# EAGLE design pwr_pos_bipolar (EAGLE 7.5.0)
Rusia Neagra MKII
TITLE: Rusia Neagra MKII
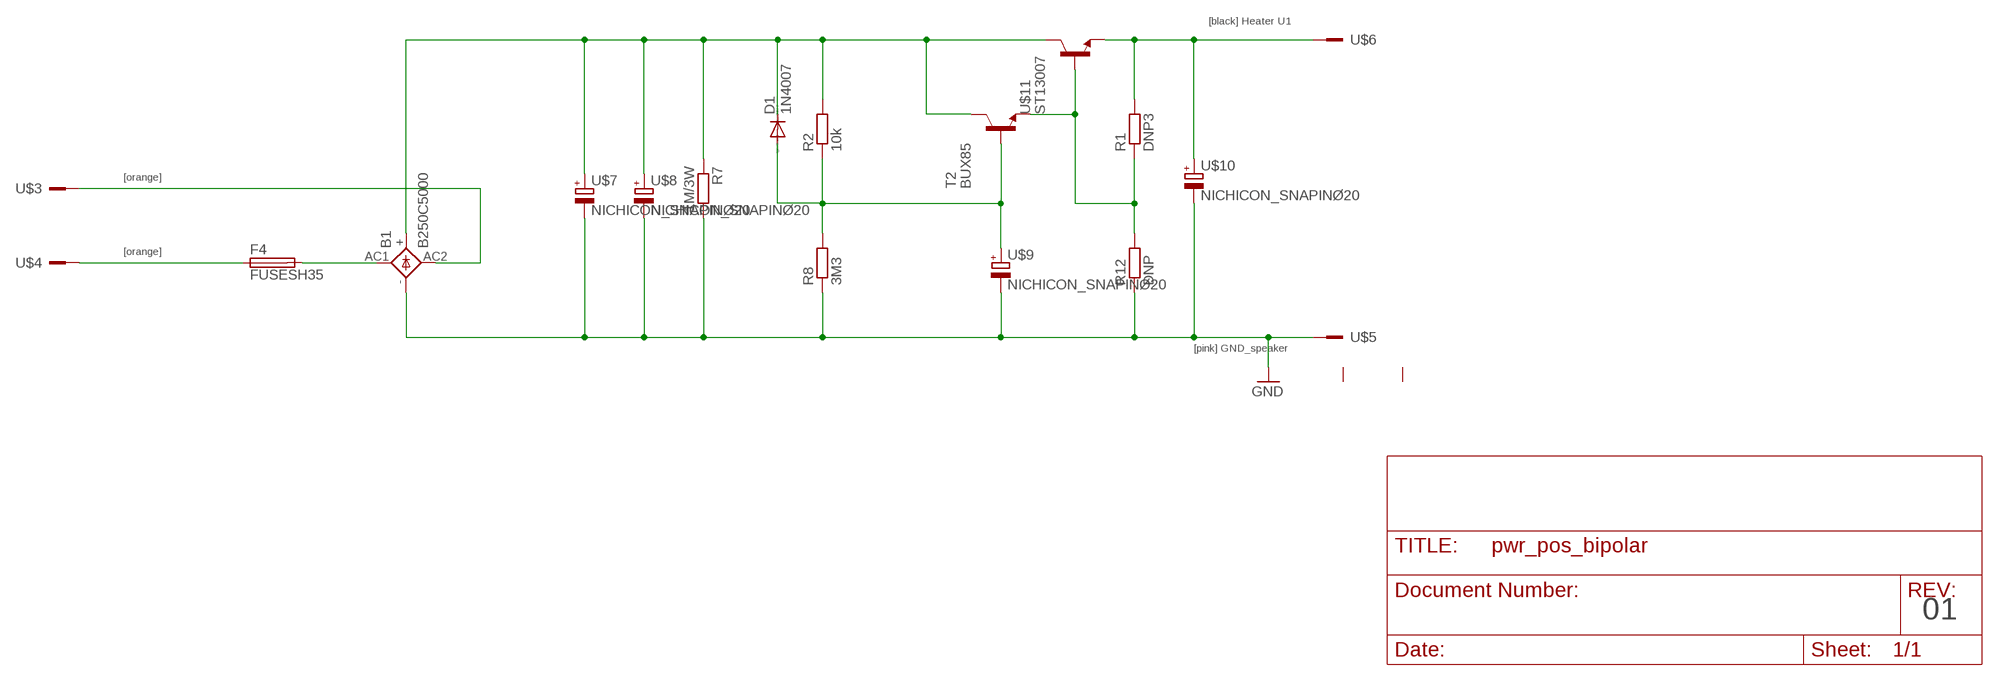
[diagram p0: schematic, sheet 1]

## Parts
B1  B250C5000  DIOTEC_BC5000  [DIOTEC_BC5000]
D1  1N4007  1N4004  [DO41-10]
F4  FUSESH35  [SH25]
R1  DNP3  R-EU_0411/12  [0411/12]
R2  10k  R-EU_0411/12  [0411/12]
R7  1M/3W  R-EU_0922V  [0922V]
R8  3M3  R-EU_0411/12  [0411/12]
R12  DNP  R-EU_0411/12  [0411/12]
T2  BUX85  -NPN-TO220V  [TO220V]
U$1  SK456-60-3XM3L  [SK456-60-3XM3L]
U$2  RN_POWER  [RN]
U$3  M1  [M1_OFFSET]
U$4  M1  [M1_OFFSET]
U$5  M1  [M1_OFFSET]
U$6  M1  [M1_OFFSET]
U$7  NICHICON_SNAPINØ20  [C_20G10]
U$8  NICHICON_SNAPINØ20  [C_20G10]
U$9  NICHICON_SNAPINØ20  [C_20G10]
U$10  NICHICON_SNAPINØ20  [C_20G10]
U$11  ST13007  NPN-POWER  [TOP3V_TO220]

## Nets
30VAC_1: B1.AC2 U$3.1(KL)
30VAC_2: F4.1 U$4.1(KL)
GND: B1.- R7.2 R8.1 R12.1 U$5.1(KL) U$7.- U$8.- U$9.- U$10.-
N$2: B1.AC1 F4.2
N$12: R1.1 R12.2 T2.3(E) U$11.B U$11.B$1(B)
N$14: D1.A R2.1 R8.2 T2.1(B) U$9.+
N_C: B1.+ D1.C R2.2 R7.1 T2.2(C) U$7.+ U$8.+ U$11.C
V-: R1.2 U$6.1(KL) U$10.+ U$11.E U$11.E$1(E)
Unconnected: U$1.P$1 U$1.P$2 U$2.SH@1 U$2.SH@2 U$2.SH@3 U$2.SH@4

## Notes on the sheet
- [black] Heater U1
- [orange]
- [orange]
- [pink] GND_speaker
- 01

## Library data of the parts
B1 = Simplex-DiscreteSemi:DIOTEC_BC5000: DIOTEC RECTIFIER B..C5000-3000A, B..C5000-3300A grid 1 x 10, 2 x 7,5 mm
D1 = diode:1N4004: DIODE general purpose rectifier, 1 A
F4 = fuse:FUSE: Fuse; OC_FARNELL: unknown; OC_NEWARK: unknown
R1 R2 R7 R8 R12 = rcl:R-EU_: RESISTOR, European symbol
T2 = transistor:*-NPN-: NPN Transistror BF959 corrected 2008.03.06
U$1 = Simplex-Heatsinks:SK456-60-3XM3L: Fischer Elektronik SK456-60-3XM3L 2 pin heatsink 60x40, 40mm grid
U$2 = Simplex-Enclosures:RN_POWER: Rusia Neagra Amp power pcb
U$3-U$6 = Simplex-Connectors:M1: 1pin
U$7-U$10 = Simplex-rlc:NICHICON_SNAPIN: Nichicon snap-in capacitors
U$11 = Simplex-DiscreteSemi:NPN-POWER

## Net classes
1 vcc: width 0.203 mm

## Board
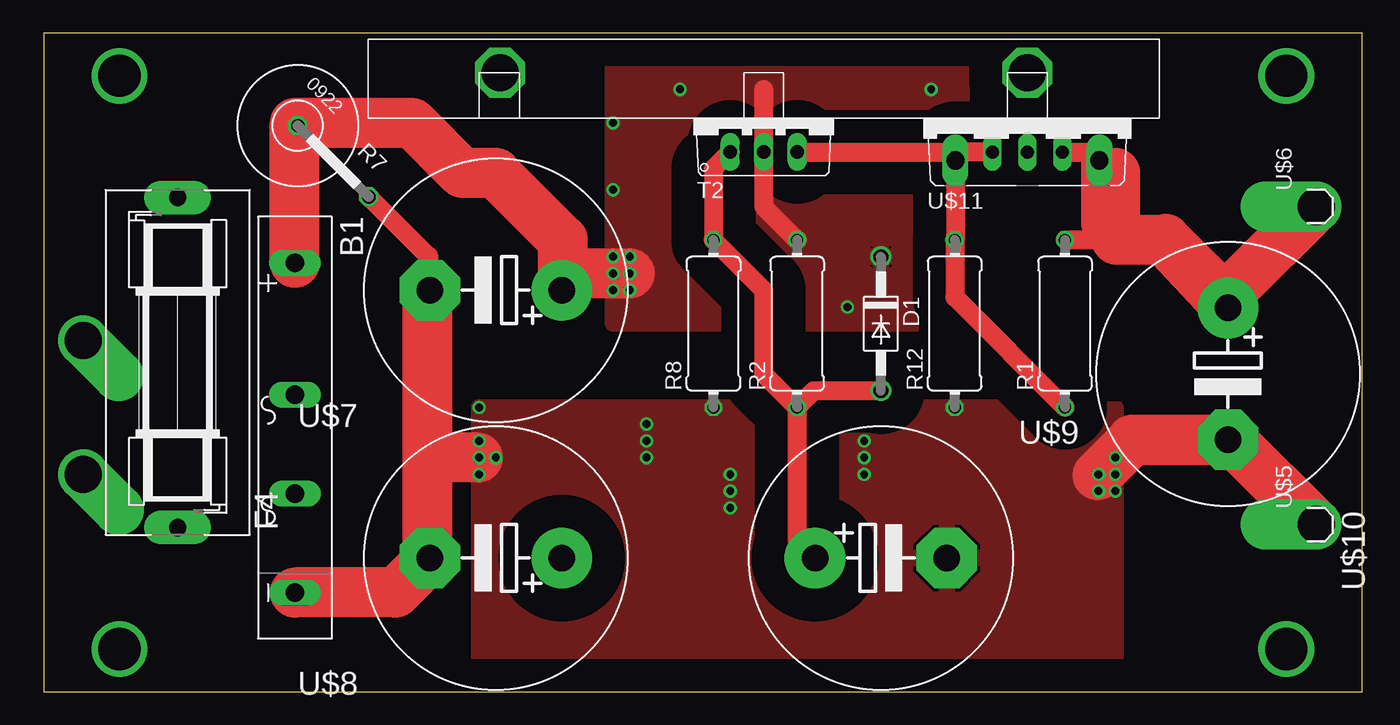
[diagram p1: board, top side]
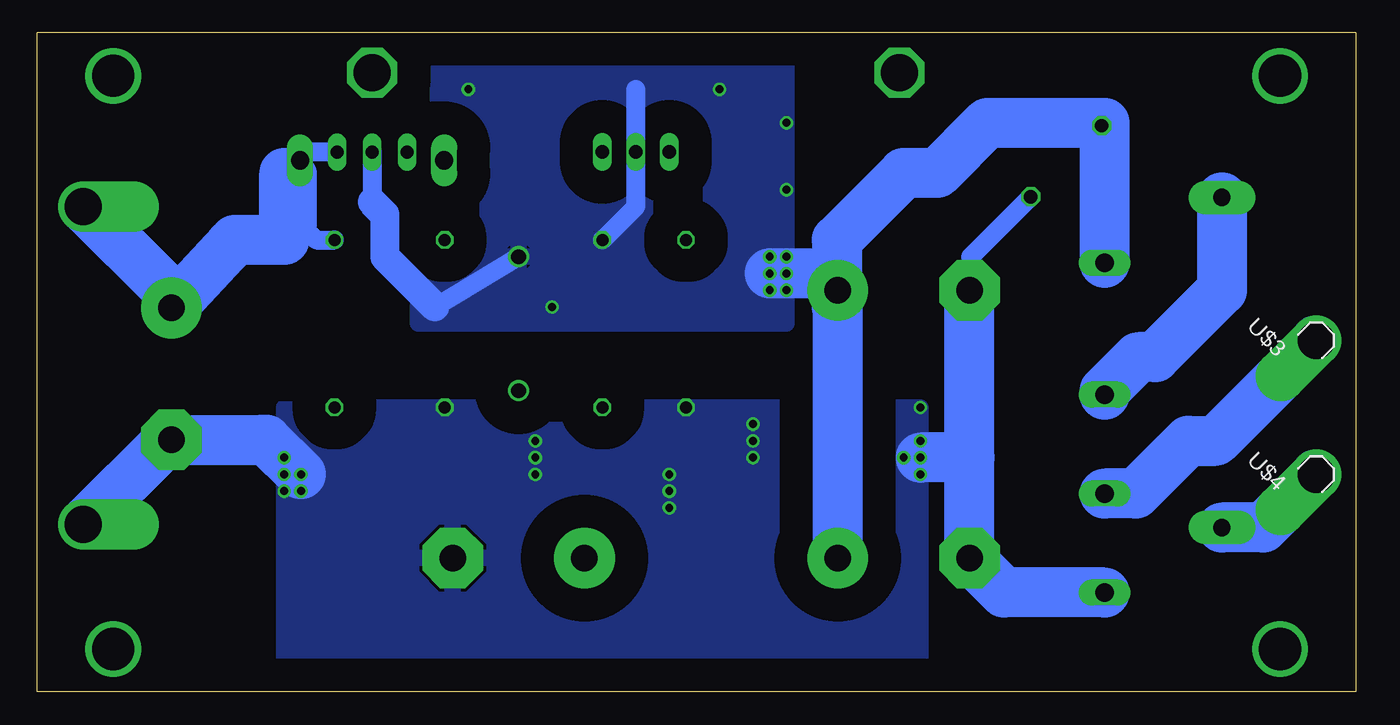
[diagram p2: board, bottom side, seen from below]

Size 100 x 50 mm. Coordinates in mm from the lower left corner, seen from the top.
Copper layers (1*16): Top 0.035mm / dielectric 1.5mm / Bottom 0.035mm
Design rules "default *": minimum track width 10mil, minimum drill 0.6mm, track to track 2mm, track to pad 2mm, pad to pad 2mm, via to via 2mm, smd to smd 2mm, copper to edge 40mil, drill to drill 8mil, minimum pad ring 0.2mm, minimum via ring 8mil, stop-mask expansion 4mil, vias tented up to drill 0mil, thermal gap 10mil

### Footprints (pad centres in the part's own frame; a part is rotated, then mirrored left to right if it is on the bottom)
DIOTEC_BC5000 = drill 1.397 long: + -13.5,0; - 11.5,0; AC1 -3.5,0; AC2 4,0
DO41-10 = drill 1.118: A 5.08,0; C -5.08,0
SH25 = drill 1.321 pad 2.54 long: 1 -12.522,0; 2 12.522,0
0411/12 = drill 0.914 octagon: 1 -6.35,0; 2 6.35,0
0922V = drill 1.016 octagon: 1 -5.08,0; 2 2.54,0
TO220V = drill 1.016 long: 1 -2.54,-2.54; 2 0,-2.54; 3 2.54,-2.54
SK456-60-3XM3L = drill 2.8 octagon: P$1 -20,0; P$2 20,0
RN = drill 3.2: SH@1 0,43.5; SH@2 88.5,43.5; SH@3 0,0; SH@4 88.5,0
M1_OFFSET = drill 2.8 pad 3.81 offset: 1 0,0
C_20G10 = drill 2.007 pad 4.597: + -5,0 | drill 2.007 pad 4.597 octagon: - 5,0
TOP3V_TO220 = drill 1.397 long: B -5.461,-3.175; E 5.461,-3.175 | drill 1 pad 1.27 long: B$1 -2.66,-2.54; C 0,-2.54; E$1 2.66,-2.54

### Placement (x,y rotation side)
B1  19.05,19.05 270 top
D1  63.5,27.94 270 top
F4  10.16,25 90 top
R1  77.47,27.94 90 top
R2  57.15,27.94 90 top
R7  22.86,39.37 315 top
R8  50.8,27.94 90 top
R12  69.1,27.94 90 top
T2  54.61,43.5 0 top
U$1  54.61,46.99 180 top
U$2  5.75,3.25 0 top
U$3  3,26.67 135 bottom
U$4  3,16.51 135 bottom
U$5  96.52,12.7 90 top
U$6  96.52,36.83 90 top
U$7  34.29,30.48 180 top
U$8  34.29,10.16 180 top
U$9  63.5,10.16 0 top
U$10  89.83,24.13 270 top
U$11  74.61,43.5 0 top

### Tracks (layer width: path | path; a pad name or v marks a point on that pad's centre or on a via)
30VAC_1
  Bottom 3.81: B1.AC2 16.7,15.05 12.7,19.05 10.62,19.05 U$3.1
30VAC_2
  Bottom 3.81: U$4.1 7.03,12.48 F4.1
GND  (via drill 0.6 pad 0.3)
  Top 0.254: 29.21,30.48 29.21,10.16 U$8.-
  Top 0.406: 29.21,33.04 29.29,33.04 U$7.-
  Top 0.813: 29.13,17.78 29.21,17.78 | 32.94,17.78 v33.02,17.78 | 26.67,7.55 26.68,7.55 U$8.- | 29.21,33.02 29.21,30.56 U$7.-
  Top 1.422: R7.2 29.21,33.02 | 29.21,30.58 29.21,33.04
  Top 3.81: U$10.- 90.09,19.13 U$5.1 | U$10.- 82.63,19.13 | 82.55,19.13 U$10.- | 79.93,16.43 82.55,19.05 | 26.67,7.55 B1.- | U$8.- 26.68,7.55 26.67,7.54 | 29.13,10.16 29.13,17.78 29.13,30.48 | 32.94,17.78 29.21,17.78
  Bottom 0.406: 80.4,15.6 80.4,19.13 82.63,19.13 U$10.-
  Bottom 1.422: R7.2 29.21,33.02 29.21,30.56 U$7.-
  Bottom 3.81: B1.- 26.68,7.55 U$8.- | 92.71,12.7 U$5.1 | 93.58,12.7 U$5.1 | U$8.- U$7.- | U$8.- 29.29,17.78 v33.02,17.78 | 90.09,19.13 U$5.1 | 82.63,19.13 v80.01,16.51 | 90.25,19.13 90.09,19.13 | 90.09,19.13 U$10.- 82.97,19.13
  other vias: 33.02,21.59 33.02,19.05 33.02,16.51 34.29,17.78 45.72,20.32 45.72,19.05 45.72,17.78 52.07,16.51 52.07,15.24 52.07,13.97 80.01,15.24 81.28,15.24 81.28,17.78 81.28,16.51 62.23,16.51 62.23,17.78 62.23,19.05
  pour Bottom (isolate 2.5): 33.02,0 33.02,21.59 81.28,21.59 81.28,0
  pour Top (isolate 2.5): 33.02,0 33.02,21.59 81.28,21.59 81.28,0
N$2
  Bottom 3.81: F4.2 10.16,30.48 15.24,25.4 16.51,25.4 19.05,22.86 B1.AC1
N$12
  Top 1.422: T2.3 68.5,40.96 69.14,40.33 U$11.B | 69.14,34.33 R12.2 | R12.2 69.1,29.96 R1.1 | U$11.B 69.15,34.29 R12.2 | U$11.B$1 69.15,40.96 U$11.B
N$14
  Top 1.422: R2.1 54.61,24.13 54.61,30.48 R8.2 50.8,39.69 T2.1 | R2.1 57.15,11.51 U$9.+ | R2.1 58.42,22.86 D1.A
N_C  (via drill 0.6 pad 0.3)
  Top 0.254: R7.1 20.1,42.96 21.59,44.45 20.32,44.45 19.05,43.18
  Top 1.422: 54.61,45.72 T2.2 54.61,36.83 R2.2
  Top 3.81: B1.+ 19.05,43.18 27.94,43.18 31.75,39.37 34.29,39.37 39.37,34.29 39.37,31.75 v44.45,31.75
  Bottom 1.422: R2.2 54.61,36.83 54.61,45.72 | U$11.C 74.61,37.18 | 69.85,29.21 D1.C
  Bottom 2.184: 74.61,37.18 73.66,36.23 73.66,33.02 69.85,29.21
  Bottom 3.81: B1.+ 19.05,43.18 27.94,43.18 31.75,39.37 34.29,39.37 39.37,34.29 39.37,31.75 | U$8.+ U$7.+ 39.29,29.21 39.37,29.21 39.37,31.75 | 39.37,31.75 v44.45,31.75
  other vias: 43.18,30.48 44.45,33.02 43.18,33.02 44.45,30.48 43.18,43.18 43.18,38.1 48.26,45.72 67.31,45.72 60.96,29.21 43.18,31.75
  pour Bottom (isolate 2.5): 43.18,49.53 71.12,49.53 71.12,27.94 43.18,27.94
  pour Top (isolate 2.5): 43.18,49.53 43.18,27.94 71.12,27.94 71.12,49.53
V-
  Top 0.254: 90.19,29.25 90.25,29.21 | 80.01,39.37 79.96,39.37 | 79.96,40.33 81.28,35.16 90.19,29.25 | 84.14,35.16 84.28,35.16 90.19,29.25
  Top 0.813: 85.09,34.37 85.09,34.29
  Top 1.422: U$11.E$1 80.07,40.96 U$11.E 81.28,39.12 81.28,35.16 80.41,34.29 R1.2
  Top 2.54: 79.96,40.33 79.96,39.37 79.96,35.51
  Top 3.81: 85.01,34.29 U$10.+ 90.17,30.48 U$6.1 | 85.09,34.37 90.25,29.21 | 81.28,35.16 81.28,39.37 | 85.09,34.29 81.36,34.29
  Bottom 0.406: 85.01,34.29 85.01,33.95 U$10.+ | 81.28,35.16 81.28,39.12 U$11.E
  Bottom 0.813: 85.01,34.29 85.09,34.29
  Bottom 1.422: 80.06,35.51 78.84,34.29 R1.2 | 80.21,40.96 79.44,40.96 | 77.41,40.96 79.44,40.96 | 79.44,40.96 U$11.E
  Bottom 2.54: 81.28,34.29 80.06,35.51 80.06,39.37
  Bottom 3.81: 93.11,36.83 U$6.1 | 96.52,36.75 U$6.1 | 81.28,34.29 85.01,34.29 | 90.17,30.48 U$6.1 | 81.28,35.16 81.28,39.37 | 85.34,33.96 U$10.+

### Text on the board
tDocu: V+ | ~ | ~ | GND | bipolar positive supply
bDocu: V+ | ~ | ~ | GND | bipolar positive supply